# Altium schematic sheet Expansition.SchDoc: Expansion/Connectors
size A4; DrawnBy: Muhammet YILDIZ; Organization: YılDıZ IoT; Revision: 1.1; SheetNumber: 3; SheetTotal: 7; SheetSize: A4
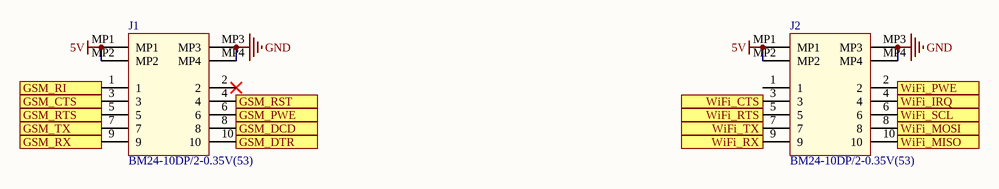
[diagram p0: Expansition.SchDoc]

## Parts
J1  BM24-10DP/2-0.35V(53)  [HIROSE BM2410DP]
J2  BM24-10DP/2-0.35V(53)  [HIROSE BM2410DP]

## Ports
GSM_CTS (in), GSM_DCD (in), GSM_DTR (out), GSM_PWE (out), GSM_RI (in), GSM_RST (out), GSM_RTS (out), GSM_RX (in), GSM_TX (out), WiFi_CTS (in), WiFi_IRQ (in), WiFi_MISO (in), WiFi_MOSI (out), WiFi_PWE (out), WiFi_RTS (out), WiFi_RX (in), WiFi_SCL (out), WiFi_TX (out)

## Nets
5V: J1.MP1 J1.MP2 J2.MP1 J2.MP2
GND: J1.MP3 J1.MP4 J2.MP3 J2.MP4
GSM_CTS: J1.3 ; port GSM_CTS
GSM_DCD: J1.8 ; port GSM_DCD
GSM_DTR: J1.10 ; port GSM_DTR
GSM_PWE: J1.6 ; port GSM_PWE
GSM_RI: J1.1 ; port GSM_RI
GSM_RST: J1.4 ; port GSM_RST
GSM_RTS: J1.5 ; port GSM_RTS
GSM_RX: J1.9 ; port GSM_RX
GSM_TX: J1.7 ; port GSM_TX
WiFi_CTS: J2.3 ; port WiFi_CTS
WiFi_IRQ: J2.4 ; port WiFi_IRQ
WiFi_MISO: J2.10 ; port WiFi_MISO
WiFi_MOSI: J2.8 ; port WiFi_MOSI
WiFi_PWE: J2.2 ; port WiFi_PWE
WiFi_RTS: J2.5 ; port WiFi_RTS
WiFi_RX: J2.9 ; port WiFi_RX
WiFi_SCL: J2.6 ; port WiFi_SCL
WiFi_TX: J2.7 ; port WiFi_TX

Not connected (* = marked no-connect by the designer): J1 2*; J2 1

## Notes on the sheet
- Title:
- Size:
- Project:
- Revision:
- Sheet
- of
- Date:
- YıLDıZ IoT
- Elperek Mahallesi
- Saray Sokak, No:12
- SAKARYA / TURKEY
- File:

## Library data of the parts
J1 J2 = 12 Pin (10 + 2 Power) B2B Header: Board to Board Connector; Manufacturer: Hirose; Pitch: 0.014inch; Mated Stacking Heights: 0.8mm; Supplier 1: Digi-Key; Supplier Part Number 1: H124923CT-ND; Manufacturer Part Number: BM24-10DP/2-0.35V(53); Stock 1: 2583; Pricing 1: 1 = 1,08000, 10 = 0,95400, 25 = 0,89760, 50 = 0,86020, 100 = 0,82280, 250 = 0,74800, 500 = 0,67320 (USD); RoHS: Yes; Mount: Surface Mount; Number of Pins: 10; Contact Plating: Gold; Packaging: Tape and Reel; Number of Rows: 2; ComponentLink1URL: https://media.digikey.com/pdf/Data%20Sheets/Hirose%20PDFs/BM24.pdf?src-supplier=Digi-Key; ComponentLink1Description: https://media.digikey.com/pdf/Data%20Sheets/Hirose%20PDFs/BM24.pdf?src-supplier=Digi-Key; ComponentLink2URL: https://www.hirose.com/product/en/download_file/key_name/BM24-10DP__2-0.35V%2853%29/category/Specification%20Sheet/doc_file_id/87039/?file_category_id=9&item_id=06772001953&is_series=&src-supplier=Digi-Key; ComponentLink2Description: https://www.hirose.com/product/en/download_file/key_name/BM24-10DP__2-0.35V%2853%29/category/Specification%20Sheet/doc_file_id/87039/?file_category_id=9&item_id=06772001953&is_series=&src-supplier=Digi-Key